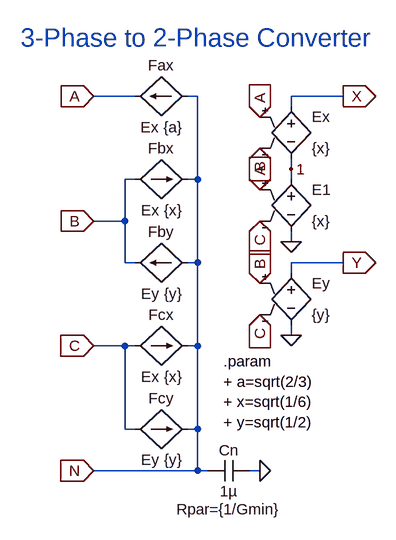
[diagram p0: schematic 3to2xfmr.asc]
3to2xfmr.asc, the LTspice schematic file:
Version 4
SHEET 1 880 680
WIRE 112 -304 48 -304
WIRE 208 -304 192 -304
WIRE 432 -304 352 -304
WIRE 352 -288 352 -304
WIRE 352 -192 352 -208
WIRE 112 -176 96 -176
WIRE 208 -176 208 -304
WIRE 208 -176 192 -176
WIRE 352 -176 352 -192
WIRE 96 -112 96 -176
WIRE 96 -112 48 -112
WIRE 352 -80 352 -96
WIRE 96 -48 96 -112
WIRE 112 -48 96 -48
WIRE 208 -48 208 -176
WIRE 208 -48 192 -48
WIRE 432 -48 352 -48
WIRE 352 -32 352 -48
WIRE 352 64 352 48
WIRE 96 80 48 80
WIRE 112 80 96 80
WIRE 208 80 208 -48
WIRE 208 80 192 80
WIRE 96 208 96 80
WIRE 112 208 96 208
WIRE 208 208 208 80
WIRE 208 208 192 208
WIRE 208 272 208 208
WIRE 208 272 48 272
WIRE 224 272 208 272
WIRE 304 272 288 272
FLAG 48 -304 A
IOPIN 48 -304 In
FLAG 48 -112 B
IOPIN 48 -112 In
FLAG 48 80 C
IOPIN 48 80 In
FLAG 352 -80 0
FLAG 304 272 0
FLAG 432 -304 X
IOPIN 432 -304 Out
FLAG 432 -48 Y
IOPIN 432 -48 Out
FLAG 48 272 N
IOPIN 48 272 In
FLAG 304 -272 A
IOPIN 304 -272 In
FLAG 304 -224 B
IOPIN 304 -224 In
FLAG 304 -112 C
IOPIN 304 -112 In
FLAG 304 -16 B
IOPIN 304 -16 In
FLAG 304 32 C
IOPIN 304 32 In
FLAG 304 -160 A
IOPIN 304 -160 In
FLAG 352 64 0
FLAG 352 -192 1
SYMBOL f 192 -304 M270
WINDOW 0 32 40 VTop 2
WINDOW 3 -32 40 VBottom 2
SYMATTR InstName Fax
SYMATTR Value Ex {a}
SYMBOL f 112 -176 R270
WINDOW 0 32 40 VTop 2
WINDOW 3 -32 40 VBottom 2
SYMATTR InstName Fbx
SYMATTR Value Ex {x}
SYMBOL f 192 -48 M270
WINDOW 0 32 40 VTop 2
WINDOW 3 -32 40 VBottom 2
SYMATTR InstName Fby
SYMATTR Value Ey {y}
SYMBOL f 112 80 R270
WINDOW 0 32 40 VTop 2
WINDOW 3 -32 40 VBottom 2
SYMATTR InstName Fcx
SYMATTR Value Ex {x}
SYMBOL f 112 208 R270
WINDOW 0 32 40 VTop 2
WINDOW 3 -32 40 VBottom 2
SYMATTR InstName Fcy
SYMATTR Value Ey {y}
SYMBOL e 352 -304 R0
WINDOW 0 32 32 Left 2
WINDOW 3 32 80 Left 2
SYMATTR InstName Ex
SYMATTR Value {x}
SYMBOL e 352 -192 R0
WINDOW 0 32 32 Left 2
WINDOW 3 32 80 Left 2
SYMATTR InstName E1
SYMATTR Value {x}
SYMBOL e 352 -48 R0
WINDOW 0 32 32 Left 2
WINDOW 3 32 80 Left 2
SYMATTR InstName Ey
SYMATTR Value {y}
SYMBOL cap 288 256 R90
WINDOW 0 0 32 VBottom 2
WINDOW 3 32 32 VTop 2
WINDOW 39 60 32 VTop 2
SYMATTR InstName Cn
SYMATTR Value 1µ
SYMATTR SpiceLine Rpar={1/Gmin}
TEXT 248 104 Left 2 !.param\n+ a=sqrt(2/3)\n+ x=sqrt(1/6)\n+ y=sqrt(1/2)
TEXT 208 -368 Bottom 4 ;3-Phase to 2-Phase Converter

The netlist it stands for:
* 3to2xfmr.asc
Fax N A Ex {a}
Fbx B N Ex {x}
Fby N B Ey {y}
Fcx C N Ex {x}
Fcy C N Ey {y}
Ex X 1 A B {x}
E1 1 0 A C {x}
Ey Y 0 B C {y}
Cn 0 N 1µ Rpar={1/Gmin}
.param
+ a=sqrt(2/3)
+ x=sqrt(1/6)
+ y=sqrt(1/2)
* 3-Phase to 2-Phase Converter
.backanno
.end